# EAGLE design Arduino_Ocelot (EAGLE 6.5.0)
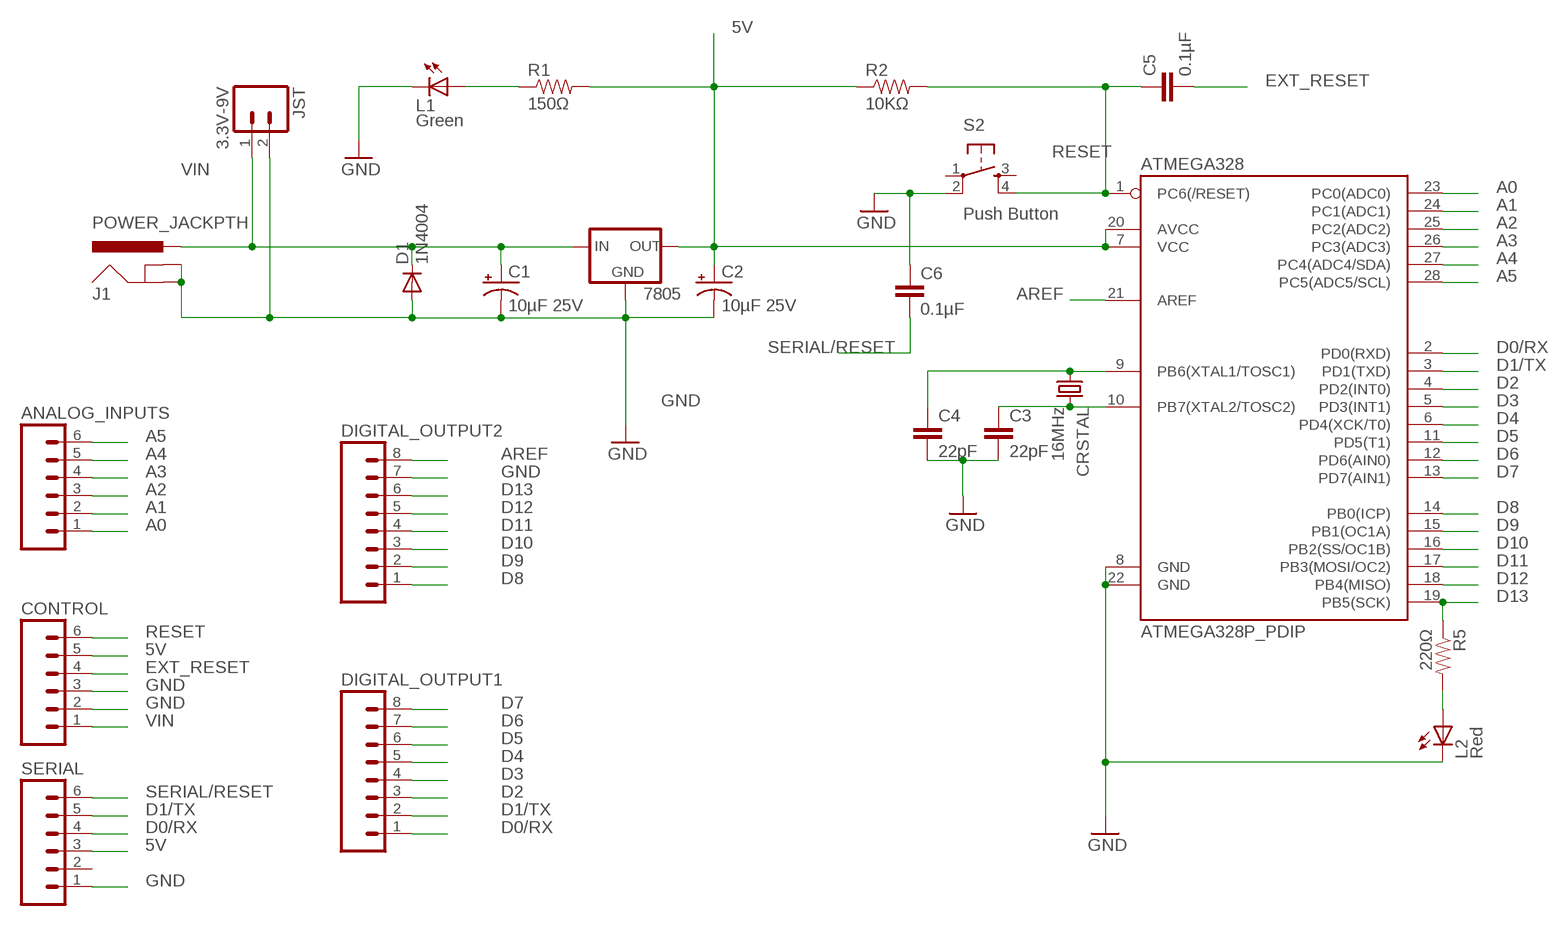
[diagram p0: schematic, sheet 1]

## Parts
7805  V_REG_78XXTO-92_UNTESTED  [TO-92]
ANALOG_INPUTS  M06FEMALE_LOCK  [1X06_FEMALE_LOCK.010]
ATMEGA328  ATMEGA328P_PDIP  [DIL28-3]
C1  10µF 25V  10UF-25V-20%(PTH)KIT  [CPOL-RADIAL-10UF-25V-KIT]
C2  10µF 25V  10UF-25V-20%(PTH)KIT  [CPOL-RADIAL-10UF-25V-KIT]
C3  22pF  0.1UF-50V-20%(PTH)KIT-EZ  [CAP-PTH-SMALL-KIT]
C4  22pF  0.1UF-50V-20%(PTH)KIT-EZ  [CAP-PTH-SMALL-KIT]
C5  0.1µF  0.1UF-50V-20%(PTH)KIT-EZ  [CAP-PTH-SMALL-KIT]
C6  0.1µF  0.1UF-50V-20%(PTH)KIT-EZ  [CAP-PTH-SMALL-KIT]
CONTROL  M06FEMALE_LOCK  [1X06_FEMALE_LOCK.010]
CRSTAL  16MHz  CRYSTALHC49US  [HC49US]
D1  1N4004  DIODE  [DIODE-1N4001-KIT]
DIGITAL_OUTPUT1  M08NO_SILK  [1X08_NO_SILK]
DIGITAL_OUTPUT2  M08NO_SILK  [1X08_NO_SILK]
J1  POWER_JACKPTH  [POWER_JACK_PTH]
JST  3.3V-9V  M02JST-PTH-VERT  [JST-2-PTH-VERT]
L1  Green  LED3MM  [LED3MM]
L2  Red  LED3MM  [LED3MM]
R1  150Ω  RESISTORPTH-1/4W  [AXIAL-0.4]
R2  10KΩ  RESISTORPTH-1/4W  [AXIAL-0.4]
R5  220Ω  RESISTORPTH-1/4W  [AXIAL-0.4]
S2  Push Button  TAC_SWITCHPTH  [TACTILE-PTH]
SERIAL  M06LOCK  [1X06_LOCK]

## Nets
5V: 7805.3(OUT) ATMEGA328.7(VCC) ATMEGA328.20(AVCC) C2.1(+) CONTROL.5 R1.P$2 R2.P$1 SERIAL.3
A0: ANALOG_INPUTS.1 ATMEGA328.23(PC0(ADC0))
A1: ANALOG_INPUTS.2 ATMEGA328.24(PC1(ADC1))
A2: ANALOG_INPUTS.3 ATMEGA328.25(PC2(ADC2))
A3: ANALOG_INPUTS.4 ATMEGA328.26(PC3(ADC3))
A4: ANALOG_INPUTS.5 ATMEGA328.27(PC4(ADC4/SDA))
A5: ANALOG_INPUTS.6 ATMEGA328.28(PC5(ADC5/SCL))
AREF: ATMEGA328.21(AREF) DIGITAL_OUTPUT2.8
D0/RX: ATMEGA328.2(PD0(RXD)) DIGITAL_OUTPUT1.1 SERIAL.4
D1/TX: ATMEGA328.3(PD1(TXD)) DIGITAL_OUTPUT1.2 SERIAL.5
D2: ATMEGA328.4(PD2(INT0)) DIGITAL_OUTPUT1.3
D3: ATMEGA328.5(PD3(INT1)) DIGITAL_OUTPUT1.4
D4: ATMEGA328.6(PD4(XCK/T0)) DIGITAL_OUTPUT1.5
D5: ATMEGA328.11(PD5(T1)) DIGITAL_OUTPUT1.6
D6: ATMEGA328.12(PD6(AIN0)) DIGITAL_OUTPUT1.7
D7: ATMEGA328.13(PD7(AIN1)) DIGITAL_OUTPUT1.8
D8: ATMEGA328.14(PB0(ICP)) DIGITAL_OUTPUT2.1
D9: ATMEGA328.15(PB1(OC1A)) DIGITAL_OUTPUT2.2
D10: ATMEGA328.16(PB2(SS/OC1B)) DIGITAL_OUTPUT2.3
D11: ATMEGA328.17(PB3(MOSI/OC2)) DIGITAL_OUTPUT2.4
D12: ATMEGA328.18(PB4(MISO)) DIGITAL_OUTPUT2.5
D13: ATMEGA328.19(PB5(SCK)) DIGITAL_OUTPUT2.6 R5.P$1
EXT_RESET: C5.2 CONTROL.4
GND: 7805.1(GND) ATMEGA328.8(GND) ATMEGA328.22(GND) C1.2(-) C2.2(-) C3.2 C4.2 C6.1 CONTROL.2 CONTROL.3 D1.A DIGITAL_OUTPUT2.7 J1.GND J1.GNDBREAK JST.2 L1.K(C) L2.K(C) S2.2 SERIAL.1
N$1: L1.A R1.P$1
N$4: ATMEGA328.10(PB7(XTAL2/TOSC2)) C3.1 CRSTAL.2
N$6: L2.A R5.P$2
PRUEBA: ATMEGA328.9(PB6(XTAL1/TOSC1)) C4.1 CRSTAL.1
RESET: ATMEGA328.1(PC6(/RESET)) C5.1 CONTROL.6 R2.P$2 S2.4
SERIAL/RESET: C6.2 SERIAL.6
VIN: 7805.2(IN) C1.1(+) CONTROL.1 D1.C J1.PWR JST.1
Unconnected: S2.1 S2.3 SERIAL.2

## Library data of the parts
7805 = SparkFun-PowerIC:V_REG_78XX: Voltage Regulator Standard 7805 5V regulator. IGO (Input Ground Output). Spark Fun Electronics SKU : COM-00107
ANALOG_INPUTS CONTROL SERIAL = SparkFun-Connectors:M06: Header 6 Standard 6-pin 0.1" header. Use with straight break away headers (SKU : PRT-00116), right angle break away headers (PRT-00553), swiss pins (PRT-00743), machine pins (PRT-00117), and female headers (PRT-00115). Molex polarized connector foot print use with SKU : PRT-08094 with associated crimp pins and housings. NOTES ON THE VARIANTS LOCK and LOCK_LONGPADS... This footprint was designed to help hold the alignment of a through-hole component (i.e. 6-pin header) while soldering it into place. You may notice that each hole has been shifted either up or down by 0.005 of an inch from it's more standard position (which is a perfectly straight line). This slight alteration caused the pins (the squares in the middle) to touch the edges of the holes. Because they are alternating, it causes a "brace" to hold the component in place. 0.005 has proven to be the perfect amount of "off-center" position when using our standard breakaway headers. Although looks a little odd when you look at the bare footprint, once you have a header in there, the alteration is very hard to notice. Also,if you push a header all the way into place, it is covered up entirely on the bottom side. This idea of altering the position of holes to aid alignment will be further integrated into the Sparkfun Library for other footprints. It can help hold any component with 3 or more connection pins.
ATMEGA328 = SparkFun-DigitalIC:ATMEGA328P_PDIP: uC used in the Arduino 32kb flash, 1k EEPROM, 2k SRAM This is the through-hole version of this chip.
C1 C2 = SparkFun-Capacitors:10UF-25V-20%(PTH): CAP-08440; PROD_ID: CAP-08440
C3-C6 = SparkFun-Capacitors:0.1UF-50V-20%(PTH): CAP-08370; PROD_ID: CAP-08370
CRSTAL = SparkFun-FreqCtrl:CRYSTAL: Various standard crystals. Proven footprints. Spark Fun Electronics SKU : COM-00534
D1 = SparkFun-DiscreteSemi:DIODE: Diode These are standard reverse protection diodes and small signal diodes. SMA package can handle up to about 1A. SOD-323 can handle about 200mA. What the SOD-323 package when ordering, there are some mfgs out there that are 5-pin packages.
DIGITAL_OUTPUT1 DIGITAL_OUTPUT2 = SparkFun-Connectors:M08: Header 8 Standard 8-pin 0.1" header. Use with straight break away headers (SKU : PRT-00116), right angle break away headers (PRT-00553), swiss pins (PRT-00743), machine pins (PRT-00117), and female headers (PRT-00115).
J1 = SparkFun-Connectors:POWER_JACK: Power Jack This is the standard 5.5mm barrel jack for power. The PTH is the most common, proven, reliable, footprint. The Slot footprint only works if the mill layer is transmitted to the PCB fab house so be warned. Mating wall wart : TOL-00298 (and others); PROD_ID: PRT-00119
JST = SparkFun-Connectors:M02: Standard 2-pin 0.1" header. Use with - straight break away headers ( PRT-00116) - right angle break away headers (PRT-00553) - swiss pins (PRT-00743) - machine pins (PRT-00117) - female headers (PRT-00115) Molex polarized connector foot print use with: PRT-08233 with associated crimp pins and housings. 2.54_SCREWTERM for use with PRT-10571. 3.5mm Screw Terminal footprints for PRT-08084 5mm Screw Terminal footprints for use with PRT-08433
L1 L2 = SparkFun-LED:LED: LEDs Standard schematic elements and footprints for 5mm, 3mm, 1206, and 0603 sized LEDs. 5mm - Spark Fun Electronics SKU : COM-00529 (and others)
R1 R2 R5 = SparkFun-Resistors:RESISTOR: Resistor Basic schematic elements and footprints for 0603, 1206, and PTH resistors.
S2 = SparkFun-Electromechanical:TAC_SWITCH: Momentary Switch Button commonly used for reset or general input. Spark Fun Electronics SKU : COM-00097 SMT- SWCH-08247

## Board
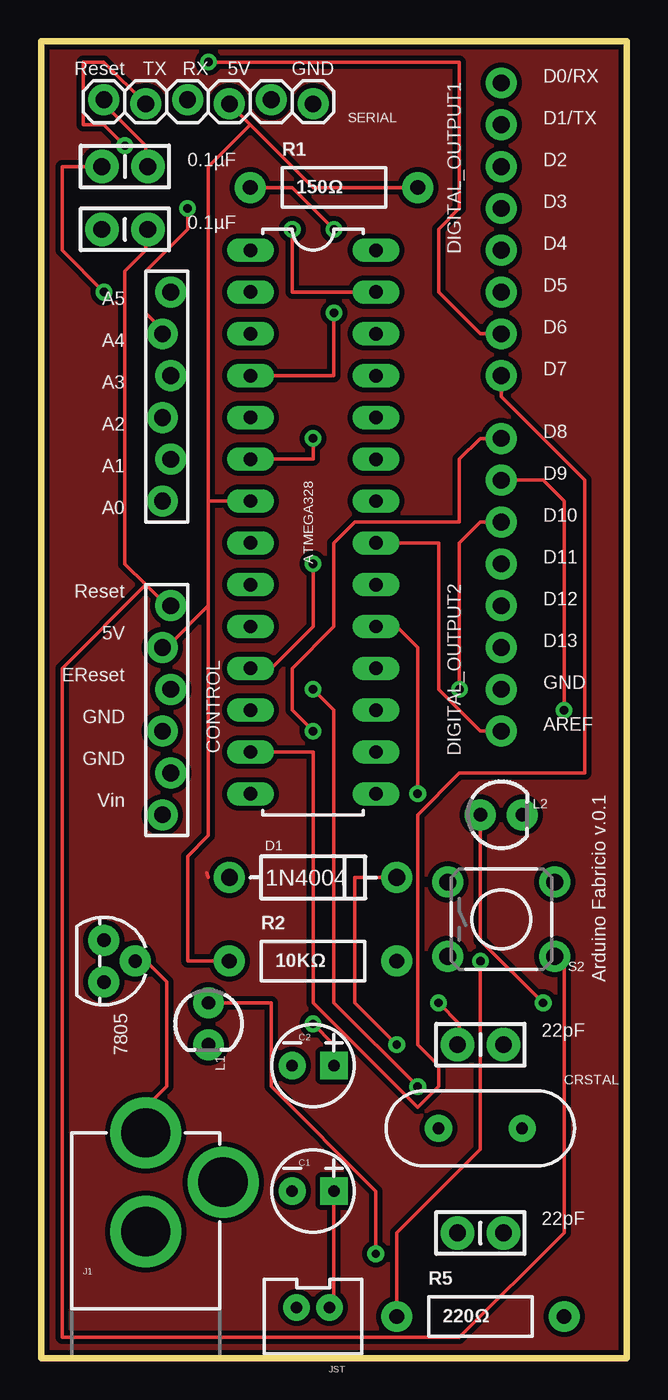
[diagram p1: board, top side]
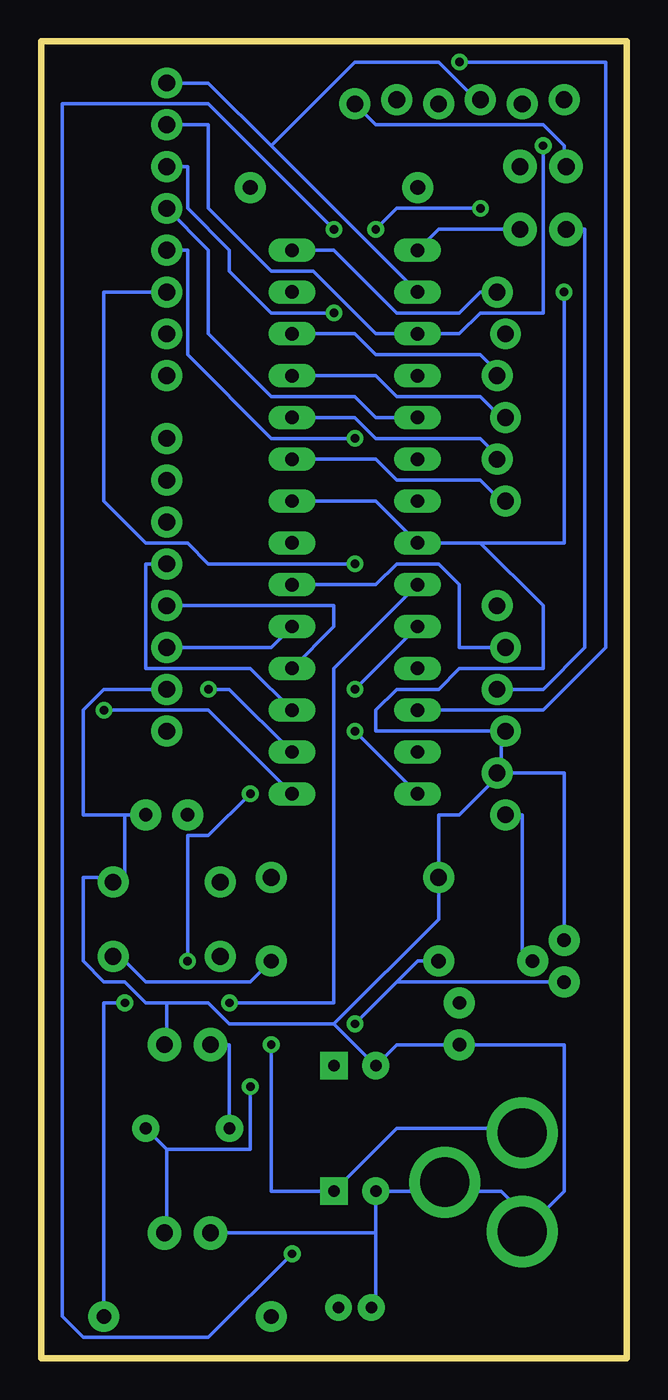
[diagram p2: board, bottom side, seen from below]

Size 35.56 x 80.01 mm. Coordinates in mm from the lower left corner, seen from the top.
Outline: 0,0 0,80.01 35.56,80.01 35.56,0 0,0
Copper layers (1*16): Top 0.035mm / dielectric 1.5mm / Bottom 0.035mm
Design rules "SparkFun": minimum track width 8mil, minimum drill 20mil, track to track 8mil, track to pad 8mil, pad to pad 8mil, via to via 8mil, smd to smd 8mil, copper to edge 8mil, drill to drill 8mil, minimum pad ring 12mil, minimum via ring 10mil, stop-mask expansion 4mil, vias tented up to drill 20mil, thermal gap 10mil

### Footprints (pad centres in the part's own frame; a part is rotated, then mirrored left to right if it is on the bottom)
TO-92 = drill 0.813 pad 1.88: 1 -1.27,0; 2 0,1.905; 3 1.27,0
1X06_FEMALE_LOCK.010 = drill 1.016 pad 1.88: 1 0,0.254; 2 2.54,-0.254; 3 5.08,0.254; 4 7.62,-0.254; 5 10.16,0.254; 6 12.7,-0.254
DIL28-3 = drill 0.813 long: 1 -16.51,-3.81; 2 -13.97,-3.81; 3 -11.43,-3.81; 4 -8.89,-3.81; 5 -6.35,-3.81; 6 -3.81,-3.81; 7 -1.27,-3.81; 8 1.27,-3.81; 9 3.81,-3.81; 10 6.35,-3.81; 11 8.89,-3.81; 12 11.43,-3.81; 13 13.97,-3.81; 14 16.51,-3.81; 15 16.51,3.81; 16 13.97,3.81; 17 11.43,3.81; 18 8.89,3.81; 19 6.35,3.81; 20 3.81,3.81; 21 1.27,3.81; 22 -1.27,3.81; 23 -3.81,3.81; 24 -6.35,3.81; 25 -8.89,3.81; 26 -11.43,3.81; 27 -13.97,3.81; 28 -16.51,3.81
CPOL-RADIAL-10UF-25V-KIT = drill 0.7 pad 1.651 square: 1 1.27,0 | drill 0.7 pad 1.651: 2 -1.27,0
CAP-PTH-SMALL-KIT = drill 1.016 pad 2.032: 1 -1.397,0; 2 1.397,0
HC49US = drill 0.7 pad 1.651: 1 -2.54,0; 2 2.54,0
DIODE-1N4001-KIT = drill 1.016 pad 1.88: A -5.08,0; C 5.08,0
1X08_NO_SILK = drill 1.016 pad 1.88: 1 0,0; 2 2.54,0; 3 5.08,0; 4 7.62,0; 5 10.16,0; 6 12.7,0; 7 15.24,0; 8 17.78,0
POWER_JACK_PTH = drill 2.997 pad 4.318: GND 0,7.7; GNDBREAK 4.7,10.7; PWR 0,13.7
JST-2-PTH-VERT = drill 0.7 pad 1.626: 1 -1,-0.55; 2 1,-0.55
LED3MM = drill 0.813 pad 1.88: A -1.27,0; K 1.27,0
AXIAL-0.4 = drill 0.9 pad 1.88: P$1 -5.08,0; P$2 5.08,0
TACTILE-PTH = drill 1.016 pad 1.88: 1 -3.251,2.261; 2 3.251,2.261; 3 -3.251,-2.261; 4 3.251,-2.261
1X06_LOCK = drill 1.016 pad 1.88: 1 0,0; 2 2.54,-0.254; 3 5.08,0; 4 7.62,-0.254; 5 10.16,0; 6 12.7,-0.254

### Placement (x,y rotation side)
7805  3.81,24.13 270 top
ANALOG_INPUTS  7.62,52.07 90 top
ATMEGA328  16.51,50.8 270 top
C1  16.51,10.16 0 top
C2  16.51,17.78 0 top
C3  26.67,7.62 180 top
C4  26.67,19.05 0 top
C5  5.08,68.58 180 top
C6  5.08,72.39 0 top
CONTROL  7.62,33.02 90 top
CRSTAL  26.67,13.97 0 top
D1  16.51,29.21 0 top
DIGITAL_OUTPUT1  27.94,77.47 270 top
DIGITAL_OUTPUT2  27.94,55.88 270 top
J1  6.35,0 0 top
JST  16.51,2.54 180 top
L1  10.16,20.32 270 top
L2  27.94,33.02 0 top
R1  17.78,71.12 0 top
R2  16.51,24.13 0 top
R5  26.67,2.54 0 top
S2  27.94,26.67 0 top
SERIAL  16.51,76.2 180 top

### Tracks (layer width: path | path; a pad name or v marks a point on that pad's centre or on a via)
5V  (via drill 0.51)
  Top 0.203: C2.1 17.78,19.05 v16.51,20.32 | 12.7,74.93 16.51,71.12 R1.P$2 | 12.7,74.93 SERIAL.3 | 10.16,52.07 ATMEGA328.7 | 10.16,45.72 10.16,52.07 | 10.16,45.72 7.62,43.18 CONTROL.5 | 12.7,74.93 10.16,72.39 10.16,52.07 | R2.P$1 8.89,24.13 8.89,30.48 10.16,31.75 10.16,45.72
  Bottom 0.203: 13.97,22.86 12.7,24.13 R2.P$1 | 13.97,22.86 v16.51,20.32 | 13.97,22.86 7805.3 | ATMEGA328.20 15.24,46.99 13.97,48.26 11.43,48.26 10.16,46.99 10.16,43.18 CONTROL.5
A0
  Bottom 0.203: ATMEGA328.23 15.24,54.61 13.97,53.34 8.89,53.34 7.62,52.07 ANALOG_INPUTS.1
A1
  Bottom 0.203: ATMEGA328.24 16.51,57.15 15.24,55.88 8.89,55.88 7.62,54.61 ANALOG_INPUTS.2
A2
  Bottom 0.203: ATMEGA328.25 15.24,59.69 13.97,58.42 8.89,58.42 7.62,57.15 ANALOG_INPUTS.3
A3
  Bottom 0.203: ATMEGA328.26 16.51,62.23 15.24,60.96 8.89,60.96 7.62,59.69 ANALOG_INPUTS.4
A4  (via drill 0.51)
  Top 0.203: ATMEGA328.27 15.24,64.77 v15.24,68.58 | v8.89,69.85 8.89,68.58 6.35,66.04 6.35,63.5 7.62,62.23 ANALOG_INPUTS.5
  Bottom 0.203: v15.24,68.58 13.97,69.85 v8.89,69.85
A5
  Bottom 0.203: ATMEGA328.28 17.78,67.31 13.97,63.5 10.16,63.5 8.89,64.77 ANALOG_INPUTS.6 7.62,64.77
AREF
  Top 0.203: ATMEGA328.21 24.13,49.53 24.13,40.64 26.67,38.1 DIGITAL_OUTPUT2.8
D0/RX
  Bottom 0.203: 21.59,73.66 25.4,77.47 DIGITAL_OUTPUT1.1 | 21.59,73.66 ATMEGA328.2 | 21.59,73.66 16.51,78.74 11.43,78.74 8.89,76.2 SERIAL.4
D1/TX  (via drill 0.51)
  Top 0.203: SERIAL.5 3.81,78.74 2.54,78.74 2.54,74.93 3.81,74.93 v5.08,73.66
  Bottom 0.203: DIGITAL_OUTPUT1.2 25.4,74.93 25.4,69.85 21.59,66.04 19.05,66.04 15.24,62.23 ATMEGA328.3 10.16,62.23 8.89,63.5 5.08,63.5 v5.08,73.66
D2  (via drill 0.51)
  Top 0.203: ATMEGA328.4 17.78,59.69 v17.78,63.5
  Bottom 0.203: v17.78,63.5 21.59,63.5 24.13,66.04 24.13,67.31 26.67,69.85 26.67,72.39 DIGITAL_OUTPUT1.3
D3
  Bottom 0.203: ATMEGA328.5 15.24,57.15 16.51,58.42 21.59,58.42 25.4,62.23 25.4,67.31 DIGITAL_OUTPUT1.4
D4  (via drill 0.51)
  Top 0.203: ATMEGA328.6 16.51,54.61 v16.51,55.88
  Bottom 0.203: v16.51,55.88 21.59,55.88 26.67,60.96 26.67,67.31 DIGITAL_OUTPUT1.5
D5  (via drill 0.51)
  Top 0.203: ATMEGA328.11 13.97,41.91 16.51,44.45 v16.51,48.26
  Bottom 0.203: v16.51,48.26 25.4,48.26 26.67,49.53 29.21,49.53 31.75,52.07 31.75,64.77 DIGITAL_OUTPUT1.6
D6  (via drill 0.51)
  Top 0.203: v10.16,78.74 25.4,78.74 25.4,69.85 24.13,68.58 24.13,64.77 26.67,62.23 DIGITAL_OUTPUT1.7
  Bottom 0.203: ATMEGA328.12 5.08,39.37 1.27,43.18 1.27,78.74 v10.16,78.74
D7
  Top 0.203: ATMEGA328.13 16.51,36.83 16.51,21.59 22.86,15.24 24.13,16.51 24.13,17.78 22.86,19.05 22.86,33.02 25.4,35.56 33.02,35.56 33.02,53.34 27.94,58.42 DIGITAL_OUTPUT1.8
D8  (via drill 0.51)
  Top 0.203: v16.51,38.1 15.24,39.37 15.24,41.91 17.78,44.45 17.78,49.53 19.05,50.8 25.4,50.8 25.4,54.61 26.67,55.88 DIGITAL_OUTPUT2.1
  Bottom 0.203: v16.51,38.1 ATMEGA328.14
D9  (via drill 0.51)
  Top 0.203: v31.75,39.37 31.75,52.07 30.48,53.34 DIGITAL_OUTPUT2.2
  Bottom 0.203: ATMEGA328.15 25.4,39.37 v31.75,39.37
D10  (via drill 0.51)
  Top 0.203: v25.4,40.64 25.4,49.53 26.67,50.8 DIGITAL_OUTPUT2.3
  Bottom 0.203: ATMEGA328.16 24.13,40.64 v25.4,40.64
D11
  Bottom 0.203: ATMEGA328.17 22.86,41.91 29.21,41.91 29.21,48.26 DIGITAL_OUTPUT2.4
D12
  Bottom 0.203: ATMEGA328.18 17.78,44.45 17.78,45.72 DIGITAL_OUTPUT2.5
D13  (via drill 0.51)
  Top 0.203: R5.P$1 21.59,7.62 26.67,12.7 v26.67,24.13 | v22.86,34.29 22.86,43.18 21.59,44.45 ATMEGA328.19
  Bottom 0.203: ATMEGA328.19 21.59,43.18 DIGITAL_OUTPUT2.6 | v26.67,24.13 26.67,31.75 25.4,31.75 v22.86,34.29
EXT_RESET
  Bottom 0.203: CONTROL.4 5.08,40.64 2.54,43.18 2.54,68.58 C5.2 3.81,68.58
GND  (via drill 0.51)
  Top 0.203: v3.81,64.77 1.27,67.31 1.27,72.39 C6.1 3.81,72.39
  Bottom 0.203: 15.24,7.62 C1.2 11.43,10.16 J1.GNDBREAK 10.16,10.16 7.62,10.16 6.35,8.89 J1.GND 6.35,7.62 3.81,10.16 3.81,19.05 L1.K 13.97,19.05 C2.2 17.78,20.32 | 15.24,7.62 15.24,3.81 JST.2 | 15.24,7.62 C3.2 25.4,7.62 | 30.48,33.02 30.48,29.21 S2.2 31.75,29.21 33.02,29.21 33.02,24.13 31.75,22.86 30.48,22.86 29.21,21.59 27.94,21.59 | L2.K 30.48,33.02 | DIGITAL_OUTPUT2.7 31.75,40.64 33.02,39.37 33.02,33.02 30.48,33.02 | 27.94,21.59 27.94,19.05 C4.2 | 17.78,20.32 24.13,20.32 25.4,21.59 27.94,21.59 | SERIAL.1 15.24,74.93 5.08,74.93 3.81,73.66 3.81,72.39 C6.1 | ATMEGA328.22 15.24,52.07 ATMEGA328.8 8.89,49.53 | 7805.1 3.81,35.56 7.62,35.56 | 7.62,35.56 10.16,33.02 11.43,33.02 D1.A 11.43,26.67 17.78,20.32 | 7.62,35.56 7.62,38.1 | 7.62,35.56 CONTROL.2 | 8.89,49.53 5.08,45.72 5.08,41.91 10.16,41.91 11.43,40.64 13.97,40.64 15.24,39.37 15.24,38.1 7.62,38.1 | 7.62,38.1 CONTROL.3 | v3.81,64.77 3.81,49.53 8.89,49.53
N$1  (via drill 0.51)
  Top 0.203: L1.A 13.97,21.59 13.97,16.51 20.32,10.16 v20.32,6.35 | v17.78,68.58 15.24,71.12 R1.P$1
  Bottom 0.203: v20.32,6.35 25.4,1.27 33.02,1.27 34.29,2.54 34.29,76.2 25.4,76.2 v17.78,68.58
N$2
  Top 0.203: 10.16,29.21 10.06,29.48
  pour Top (isolate 0.305): 0,0 0,80.01 35.56,80.01 35.56,0
N$4  (via drill 0.51)
  Top 0.203: v16.51,40.64 17.78,39.37 17.78,21.59 v22.86,16.51
  Bottom 0.203: v16.51,40.64 ATMEGA328.10 | v22.86,16.51 22.86,12.7 27.94,12.7 | CRSTAL.2 27.94,12.7 | 27.94,12.7 27.94,7.62 C3.1
N$6  (via drill 0.51)
  Top 0.203: v30.48,21.59 26.67,25.4 L2.A
  Bottom 0.203: R5.P$2 31.75,21.59 v30.48,21.59
PRUEBA  (via drill 0.51)
  Top 0.203: v24.13,21.59 25.4,20.32 25.4,19.05 C4.1
  Bottom 0.203: ATMEGA328.9 17.78,41.91 17.78,21.59 v24.13,21.59 | CRSTAL.1 24.13,19.05 C4.1 25.4,19.05
RESET
  Top 0.203: 6.35,46.99 5.08,48.26 5.08,66.04 6.35,67.31 6.35,68.58 C5.1 | 6.35,46.99 7.62,45.72 CONTROL.6 | 6.35,46.99 1.27,41.91 1.27,1.27 25.4,1.27 31.75,7.62 31.75,24.13 S2.4
  Bottom 0.203: R2.P$2 22.86,22.86 29.21,22.86 30.48,24.13 S2.4 | ATMEGA328.1 11.43,68.58 C5.1 6.35,68.58
SERIAL/RESET
  Top 0.203: SERIAL.6 3.81,76.2 6.35,73.66 6.35,72.39 C6.2
VIN  (via drill 0.51)
  Top 0.203: C1.1 17.78,3.81 JST.1 | D1.C 19.05,29.21 19.05,21.59 v21.59,19.05 | J1.PWR 6.35,15.24 7.62,16.51 7.62,22.86 6.35,24.13 7805.2
  Bottom 0.203: v21.59,19.05 21.59,10.16 C1.1 13.97,13.97 6.35,13.97 J1.PWR | 7805.2 6.35,24.13 6.35,33.02 CONTROL.1 7.62,33.02

### Text on the board
tPlace: Reset | TX | RX | 5V | GND | D0/RX | D1/TX | 0.1µF | D2 | D3 | 0.1µF | D4 | A5 | D5 | A4 | D6 | A3 | D7 | A2 | D8 | A1 | D9 | A0 | D10 | D11 | Reset | D12 | 5V | D13 | EReset | GND | GND | AREF | GND | Vin | Arduino Fabricio v.0.1 | 22pF | 22pF